# Altium project VIGIA_2_3.PrjPcb
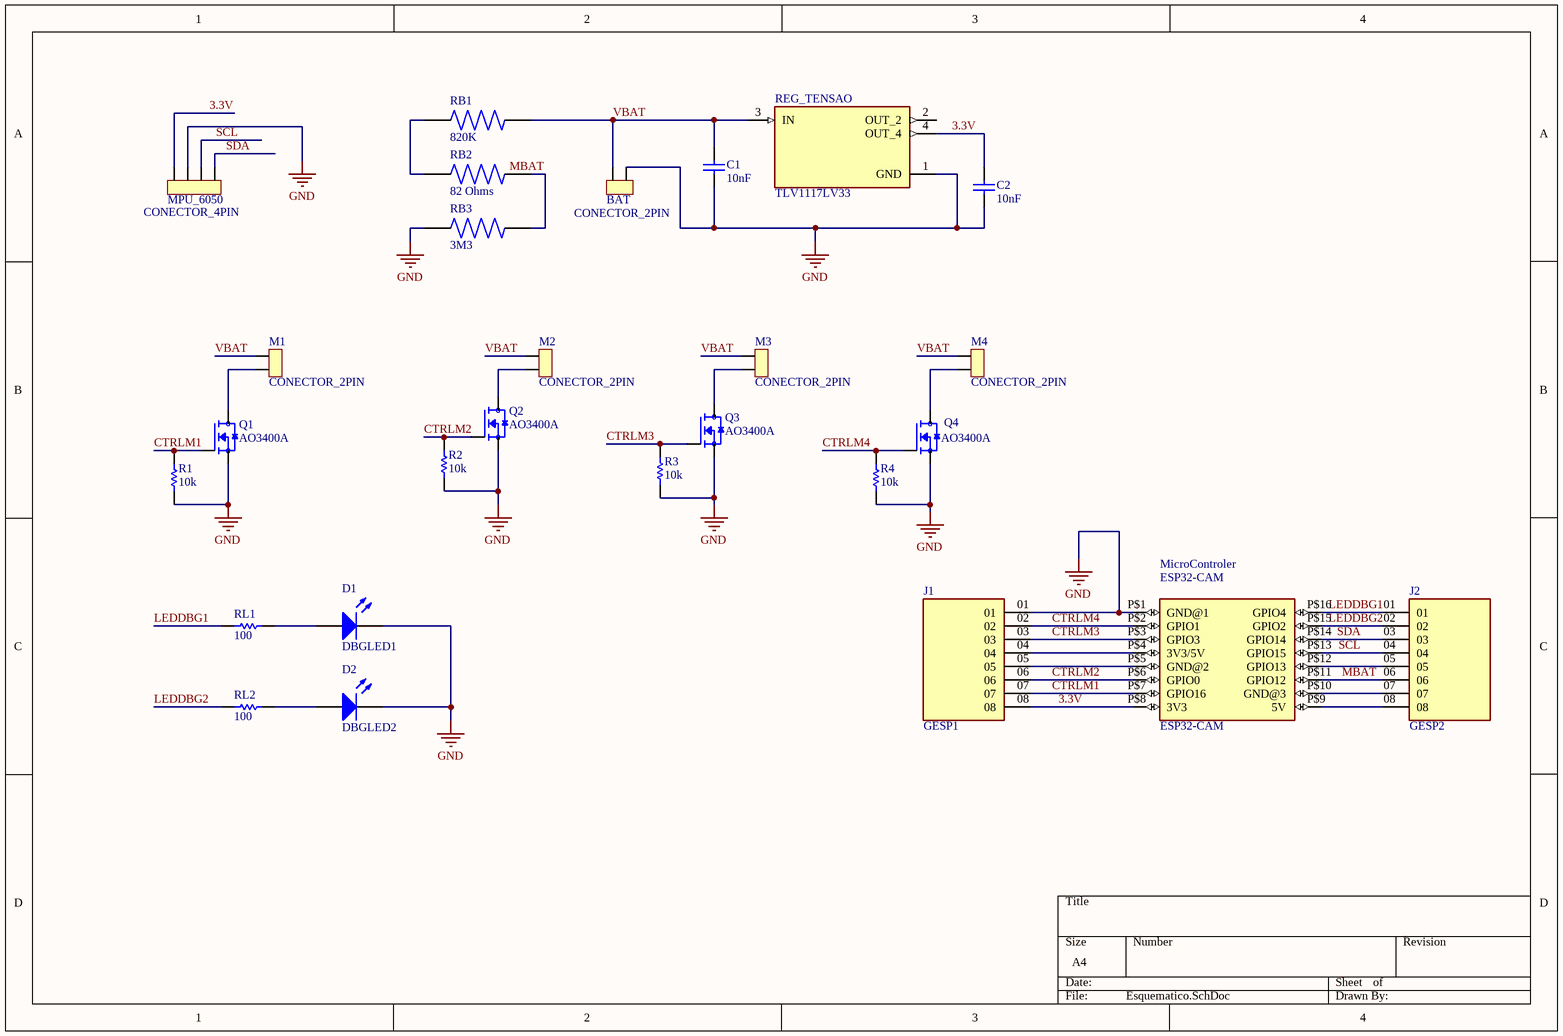
[diagram p0: Esquematico.SchDoc]
1 sheet, 27 parts. Net scope: global (net labels, ports and power ports of the same name join across sheets).
Board file: VIGIA_2_3.PcbDoc

## Sheet Esquematico.SchDoc
size A4; SheetNumber: 1; SheetTotal: 1

### Parts
BAT  CONECTOR_2PIN  [CON2]
C1  Valor: 10nF  [CAP 0805]  (hidden comment: CAP)
C2  Valor: 10nF  [CAP 0805]  (hidden comment: CAP)
D1  DBGLED1  [LED 0805]
D2  DBGLED2  [LED 0805]
J1  GESP1  [SAMTEC_SS-108-T-2]
J2  GESP2  [SAMTEC_SS-108-T-2]
M1  CONECTOR_2PIN  [CON2]
M2  CONECTOR_2PIN  [CON2]
M3  CONECTOR_2PIN  [CON2]
M4  CONECTOR_2PIN  [CON2]
MicroControler  ESP32-CAM  [ESP32-CAM]
MPU_6050  CONECTOR_4PIN  [CON4]
Q1  AO3400A  [SOT95P280X125-3N]
Q2  AO3400A  [SOT95P280X125-3N]
Q3  AO3400A  [SOT95P280X125-3N]
Q4  AO3400A  [SOT95P280X125-3N]
R1  value 10k  [RES 0805]  (hidden comment: RESISTOR)
R2  value 10k  [RES 0805]  (hidden comment: RESISTOR)
R3  value 10k  [RES 0805]  (hidden comment: RESISTOR)
R4  value 10k  [RES 0805]  (hidden comment: RESISTOR)
RB1  820K  [RESAD700W45L350D185]
RB2  82 Ohms  [RESAD700W45L350D185]
RB3  3M3  [RESAD700W45L350D185]
REG_TENSAO  TLV1117LV33  [VREG_TLV1117LV33DCYR]
RL1  value 100  [RES 0805]  (hidden comment: RESISTOR)
RL2  value 100  [RES 0805]  (hidden comment: RESISTOR)

### Nets
GND: BAT.2 C1.1 C2.1 D1.2(K) D2.2(K) J1.01 MicroControler.P$1(GND@1) MPU_6050.2 Q1.2(S) Q2.2(S) Q3.2(S) Q4.2(S) R1.1 R2.1 R3.1 R4.1 RB3.1 REG_TENSAO.1(GND)
3.3V: C2.2 J1.08 MicroControler.P$8(3V3) MPU_6050.1 REG_TENSAO.4(OUT_4)
CTRLM1: J1.07 MicroControler.P$7(GPIO16) Q1.1(G) R1.2
CTRLM2: J1.06 MicroControler.P$6(GPIO0) Q2.1(G) R2.2
CTRLM3: J1.03 MicroControler.P$3(GPIO3) Q3.1(G) R3.2
CTRLM4: J1.02 MicroControler.P$2(GPIO1) Q4.1(G) R4.2
LEDDBG1: J2.01 MicroControler.P$16(GPIO4) RL1.1
LEDDBG2: J2.02 MicroControler.P$15(GPIO2) RL2.1
MBAT: J2.06 MicroControler.P$11(GPIO12) RB2.2 RB3.2
SCL: J2.04 MicroControler.P$13(GPIO15) MPU_6050.3
SDA: J2.03 MicroControler.P$14(GPIO14) MPU_6050.4
VBAT: BAT.1 C1.2 M1.2 M2.2 M3.2 M4.2 RB1.2 REG_TENSAO.3(IN)
NetD1_1: D1.1(A) RL1.2
NetD2_1: D2.1(A) RL2.2
NetJ1_04: J1.04 MicroControler.P$4(3V3/5V)
NetJ1_05: J1.05 MicroControler.P$5(GND@2)
NetJ2_05: J2.05 MicroControler.P$12(GPIO13)
NetJ2_07: J2.07 MicroControler.P$10(GND@3)
NetJ2_08: J2.08 MicroControler.P$9(5V)
NetM1_1: M1.1 Q1.3(D)
NetM2_1: M2.1 Q2.3(D)
NetM3_1: M3.1 Q3.3(D)
NetM4_1: M4.1 Q4.3(D)
NetRB1_1: RB1.1 RB2.1

Not connected (* = marked no-connect by the designer): REG_TENSAO 2(OUT_2)

### Library data of the parts
C1 C2 = CAP. CERÂMICO: Capacitor; Criador por: Luigi Eduardo; Pertence a: Trincabotz; Criado em: 26/06/2012
D1 D2 = LED
J1 J2 = SS-108-T-2: SS Series .100 Single Row Screw Machine Socket Strip; MF: Samtec; MP: SS-108-T-2; SnapEDA_Link: https://www.snapeda.com/parts/SS-108-T-2/Samtec/view-part/3323909/?ref=snap; Availability: Bad; Package: None; Value: *; Price: None
  J2: Check_prices: SLA
MicroControler = ESP32-CAM: ESP32 ESP32 Transceiver; 802.11 a/b/g/n (Wi-Fi, WiFi, WLAN), BluetoothÂ® Smart 4.x Low Energy (BLE) Evaluation Board; MF: AI-Thinker; SnapEDA_Link: https://www.snapeda.com/parts/ESP32-CAM/AI-Thinker/view-part/?ref=snap; Package: None; Value: *; MP: ESP32-CAM; Check_prices: https://www.snapeda.com/parts/ESP32-CAM/AI-Thinker/view-part/?ref=eda
Q1-Q4 = AO3400A: N-Channel 30 V 5.7A (Ta) 1.4W (Ta) Surface Mount SOT-23-3; MF: Alpha & Omega Semiconductor; SnapEDA_Link: https://www.snapeda.com/parts/AO3400A/Alpha/view-part/?ref=snap; Package: SOT-23 Alpha &amp; Omega Semiconductor Inc.; Value: *; MP: AO3400A; Check_prices: https://www.snapeda.com/parts/AO3400A/Alpha/view-part/?ref=eda
RB1-RB3 = 3-1623927-1: 1 MOhms Â±5% 0.25W, 1/4W Through Hole Resistor Axial - Carbon Film; MF: TE Connectivity; SnapEDA_Link: https://www.snapeda.com/parts/3-1623927-1/TE+Connectivity/view-part/?ref=snap; Package: None; Value: *; MP: 3-1623927-1; Check_prices: https://www.snapeda.com/parts/3-1623927-1/TE+Connectivity/view-part/?ref=eda
REG_TENSAO = TLV1117LV33DCYR: 1-A, low-dropout voltage regulator; MF: Texas Instruments; SnapEDA_Link: https://www.snapeda.com/parts/TLV1117LV33DCYR/Texas+Instruments/view-part/?ref=snap; Package: SOT-223-4 Texas Instruments; Value: *; MP: TLV1117LV33DCYR; Check_prices: https://www.snapeda.com/parts/TLV1117LV33DCYR/Texas+Instruments/view-part/?ref=eda